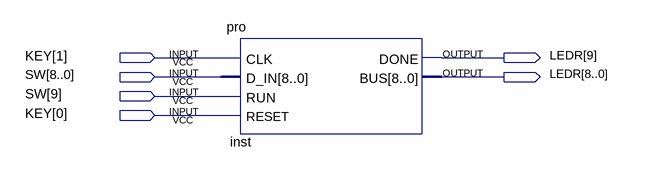
[diagram p0: schematic sheet]
// Quartus schematic part1_sch.bdf as structural Verilog: 1 symbols, 6 pins
module part1_sch (
  input  [1:0] KEY,
  input  [9:0] SW,
  output [9:0] LEDR
);

  pro inst (.CLK(KEY[1]), .D_IN(SW[8:0]), .RUN(SW[9]), .RESET(KEY[0]), .DONE(LEDR[9]), .BUS(LEDR[8:0]));
endmodule
